# EAGLE design Thermocouple (EAGLE 7.3.0)
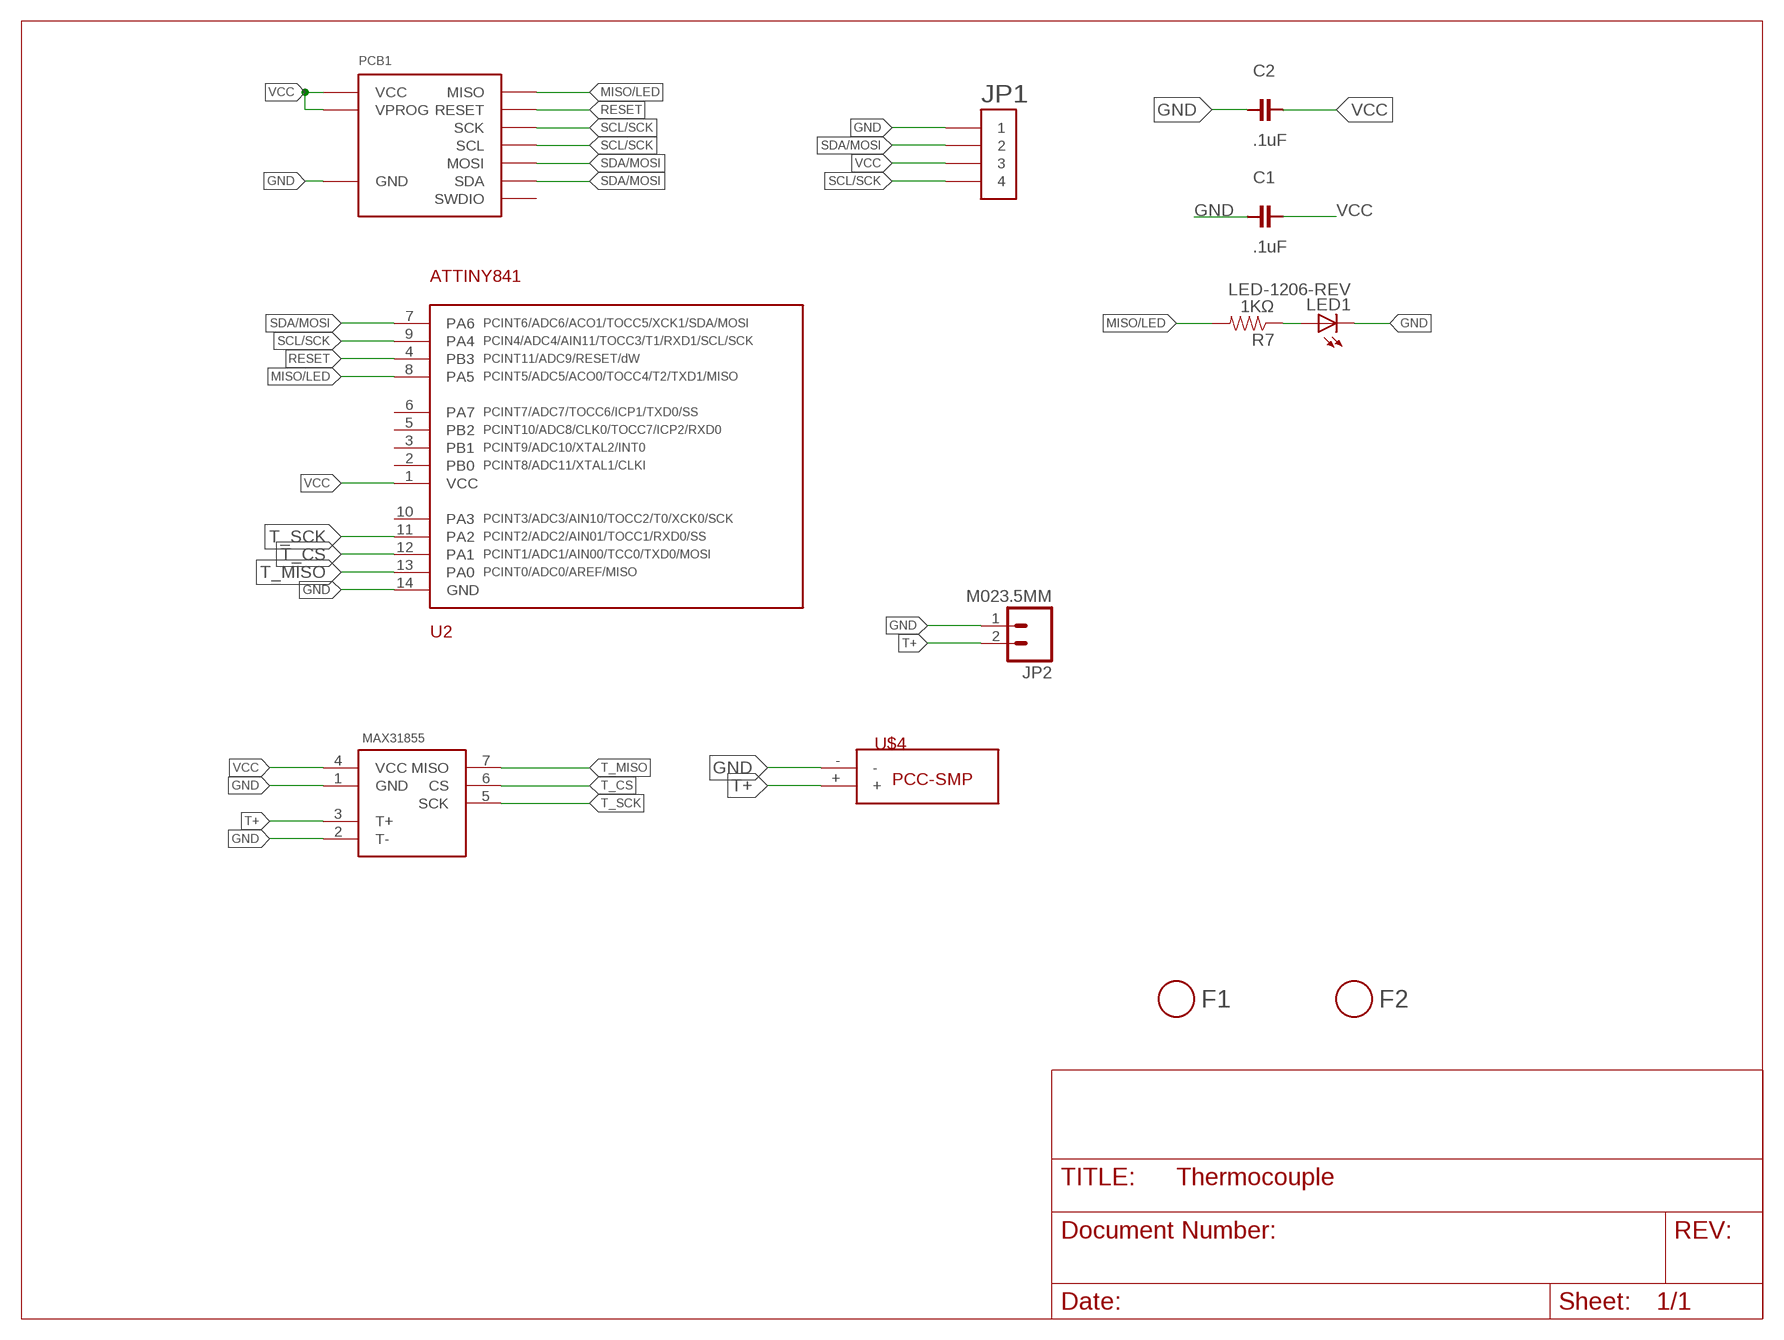
[diagram p0: schematic, sheet 1]
FRAME1 (LETTER_L): BOM: EXCLUDE

## Parts
C1  .1uF  CAPACITOR-.1UF  [0603]
C2  .1uF  CAPACITOR-.1UF  [0603]
F1  FIDUCIAL  [FIDUCIAL_1MM]
F2  FIDUCIAL  [FIDUCIAL_1MM]
JP1  HEADER-1X4-AMPMODU  [AMPMODU-4P]
JP2  M023.5MM  [SCREWTERMINAL-3.5MM-2]
LED1  LED-1206-REV  [LED-1206-REV]
PCB1  DEVICE-PCB  [DEVICE-PCB]
R7  1KΩ  RESISTOR-1KΩ  [0603]
U2  ATTINY841  [SOIC-14]
U$4  PCC-SMP  [PCC-SMP]
U$5  MAX31855  [SOIC-8]

## Nets
GND: C1.2 C2.2 JP1.P$1 JP1.P$2 JP2.1 LED1.C PCB1.GND U2.14(GND) U$4.- U$5.1(GND) U$5.2(T-)
MISO/LED: PCB1.MISO R7.2 U2.8(PA5)
N$7: LED1.A R7.1
RESET: PCB1.RESET U2.4(PB3)
SCL/SCK: JP1.P$7 JP1.P$8 PCB1.CLK(SCK) PCB1.SCL U2.9(PA4)
SDA/MOSI: JP1.P$3 JP1.P$4 PCB1.MOSI PCB1.SDA U2.7(PA6)
T+: JP2.2 U$4.+ U$5.3(T+)
T_CS: U2.12(PA1) U$5.6(CS)
T_MISO: U2.13(PA0) U$5.7(MISO)
T_SCK: U2.11(PA2) U$5.5(SCK)
VCC: C1.1 C2.1 JP1.P$5 JP1.P$6 PCB1.VCC PCB1.VPROG U2.1(VCC) U$5.4(VCC)
Unconnected: PCB1.SWDIO U2.2(PB0) U2.3(PB1) U2.5(PB2) U2.6(PA7) U2.10(PA3)

## Library data of the parts
C1 C2 = Modulo:CAPACITOR: Capacitor; PARTNUM: C0603C104K5RACTU
F1 F2 = Modulo:FIDUCIAL; BOM: EXCLUDE
JP1 = Modulo:HEADER-1X4; PARTNUM: 147721-3
JP2 = SparkFun-Connectors:M02: Standard 2-pin 0.1" header. Use with - straight break away headers ( PRT-00116) - right angle break away headers (PRT-00553) - swiss pins (PRT-00743) - machine pins (PRT-00117) - female headers (PRT-00115) Molex polarized connector foot print use with: PRT-08233 with associated crimp pins and housings. 2.54_SCREWTERM for use with PRT-10571. 3.5mm Screw Terminal footprints for PRT-08084 5mm Screw Terminal footprints for use with PRT-08433
LED1 = Modulo:LED: LED; PARTNUM: LTST-C230TBKT
PCB1 = Modulo:DEVICE-PCB: Modulo Footprint; PARTNUM: Therm PCB
R7 = Modulo:RESISTOR: Resistor Basic schematic elements and footprints for 0603, 1206, and PTH resistors.; PARTNUM: ERJ-3EKF1001V
U2 = Modulo:ATTINY841; PARTNUM: ATTINY841-SSUR
U$4 = Modulo:PCC-SMP
U$5 = IntegerLabs:MAX31855

## Board
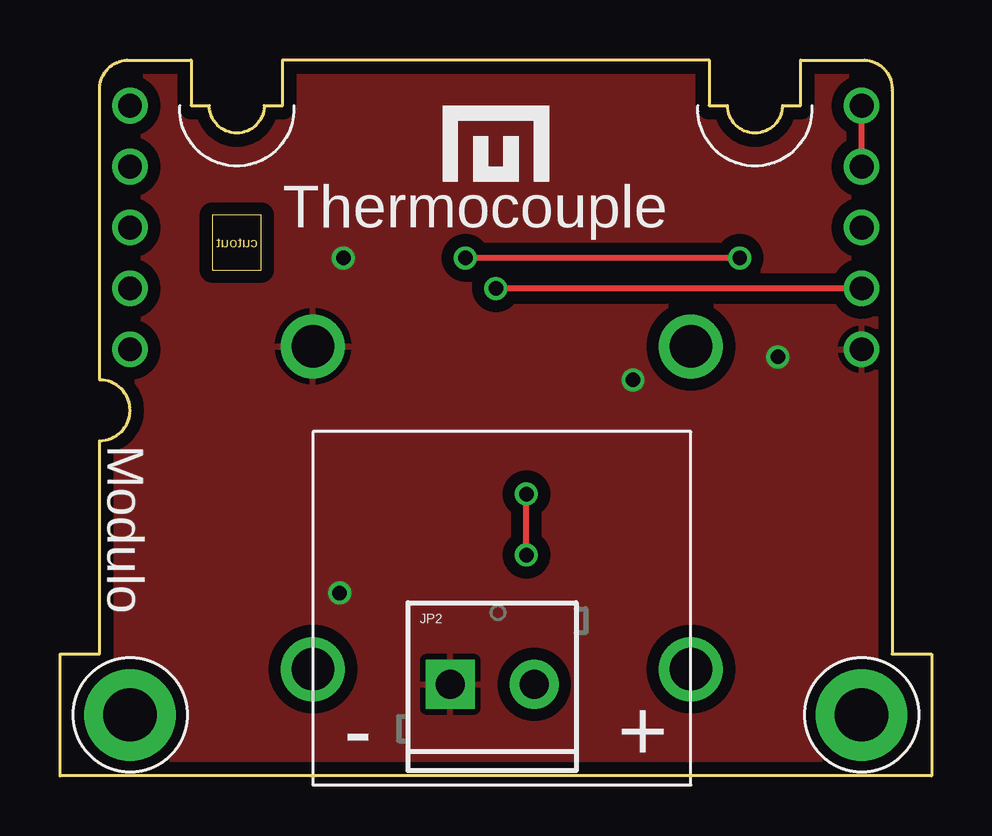
[diagram p1: board, top side]
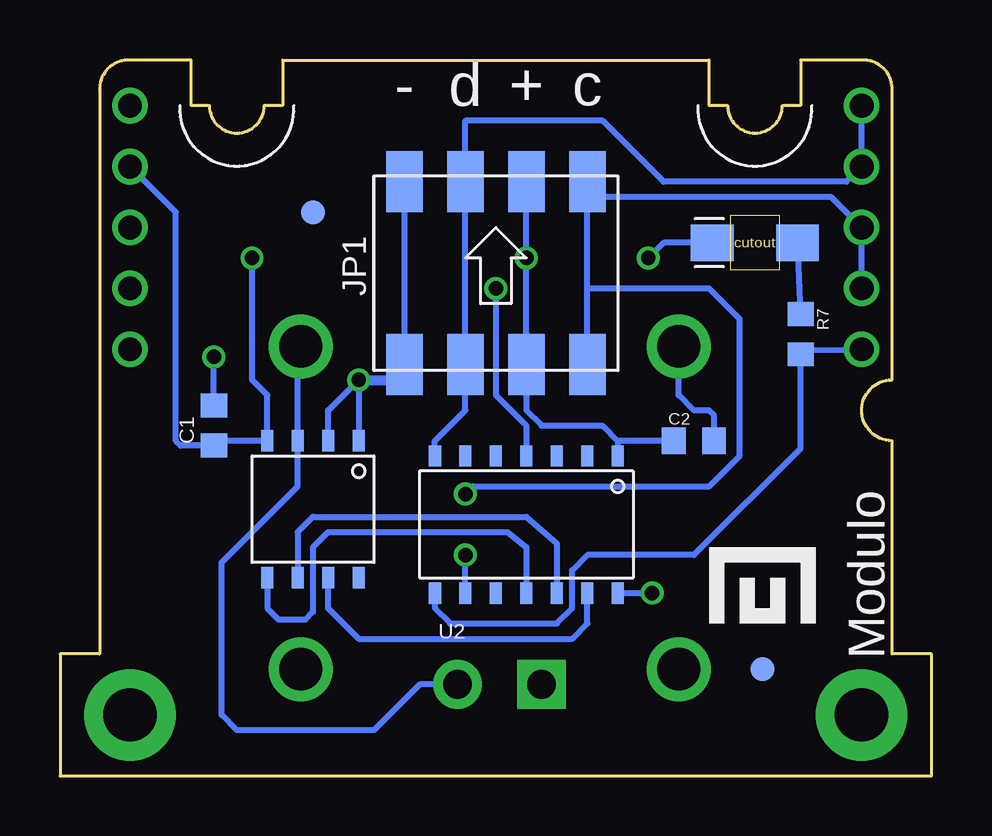
[diagram p2: board, bottom side, seen from below]

Size 36.32 x 29.84 mm. Coordinates in mm from the lower left corner, seen from the top.
Copper layers (1*16): Top 0.0356mm / dielectric 1.5011mm / Bottom 0.0356mm
Design rules "Modulo": minimum track width 6mil, minimum drill 13mil, track to track 6mil, track to pad 6mil, pad to pad 6mil, via to via 6mil, smd to smd 6mil, copper to edge 15mil, drill to drill 6mil, minimum pad ring 7mil, minimum via ring 7mil, stop-mask expansion 3mil, vias tented up to drill 25mil, thermal gap 10mil

### Footprints (pad centres in the part's own frame; a part is rotated, then mirrored left to right if it is on the bottom)
0603 = smd 0.991 x 1.092: 1 -0.838,0; 2 0.838,0
FIDUCIAL_1MM = smd 1 x 1: 1 0,0
AMPMODU-4P = smd 1.524 x 2.54: P$1 -3.81,3.81; P$2 -3.81,-3.81; P$3 -1.27,3.81; P$4 -1.27,-3.81; P$5 1.27,3.81; P$6 1.27,-3.81; P$7 3.81,3.81; P$8 3.81,-3.81
SCREWTERMINAL-3.5MM-2 = drill 1.2 pad 2.032 square: 1 0,0 | drill 1.2 pad 2.032: 2 3.5,0
LED-1206-REV = smd 1.778 x 1.524: A -1.778,0; C 1.778,0
DEVICE-PCB = drill 0.991: CLK 2.54,20.32; GND 33.02,17.78; MISO 2.54,17.78; MOSI 2.54,25.4; RESET 33.02,20.32; SCL 2.54,22.86; SDA 2.54,27.94; SWDIO 33.02,22.86; VCC 33.02,25.4; VPROG 33.02,27.94 | drill 2.223 pad 3.81: P$1 2.54,2.54; P$2 33.02,2.54
SOIC-14 = smd 0.508 x 0.889: 1 0,-3.175; 2 1.27,-3.175; 3 2.54,-3.175; 4 3.81,-3.175; 5 5.08,-3.175; 6 6.35,-3.175; 7 7.62,-3.175; 8 7.62,2.54; 9 6.35,2.54; 10 5.08,2.54; 11 3.81,2.54; 12 2.54,2.54; 13 1.27,2.54; 14 0,2.54
PCC-SMP = drill 1.778: + 15.748,13.462; - 0,13.462; NC1 0,0; NC2 15.748,0
SOIC-8 = smd 0.508 x 0.889: 1 -1.27,-3.175; 2 0,-3.175; 3 1.27,-3.175; 4 2.54,-3.175; 5 2.54,2.54; 6 1.27,2.54; 7 0,2.54; 8 -1.27,2.54

### Placement (x,y rotation side)
C1  29.91,14.61 90 bottom
C2  9.91,13.97 0 bottom
F1  7.05,4.45 0 bottom
F2  25.78,23.5 0 bottom
JP1  18.16,20.95 0 bottom
JP2  16.26,3.81 0 top
LED1  7.37,22.23 180 bottom
PCB1  0.38,0 0 top
R7  5.46,18.41 270 bottom
U2  13.08,10.16 180 bottom
U$2  [LOGO-SMALL]  7.37,6.99 0 bottom
U$3  [LOGO-SMALL]  17.84,25.4 0 top
U$4  10.54,4.45 0 top
U$5  25.15,10.79 180 bottom

### Tracks (layer width: path | path; a pad name or v marks a point on that pad's centre or on a via)
GND  (via drill 0.6)
  Bottom 0.254: LED1.C 11.18,22.23 v11.81,21.59 | U2.14 v11.65,7.62 | C1.2 v29.91,17.46 | JP1.P$1 JP1.P$2 | C2.2 9.07,15.04 9.27,15.24 9.91,15.24 10.54,15.88 U$4.- | U$5.1 v23.88,16.51 25.15,15.24 U$5.2
  Bottom 0.406: v23.88,16.51 22.61,16.51 JP1.P$2
  pour Top (isolate 0.508, rank 2): 35.94,0 35.94,30.48 0.38,30.48 0.38,0
MISO/LED
  Bottom 0.254: PCB1.MISO 5.27,17.75 R7.2 5.46,13.65 9.91,9.21 14.35,9.21 14.99,8.57 14.99,6.99 15.62,6.35 20.07,6.35 20.7,6.99 U2.8
N$7
  Bottom 0.254: R7.1 LED1.A
RESET  (via drill 0.6)
  Top 0.254: PCB1.RESET v18.16,20.32
  Bottom 0.254: v18.16,20.32 18.16,15.88 16.89,14.61 U2.4
SCL/SCK  (via drill 0.6)
  Top 0.254: v19.43,9.21 v19.43,11.75
  Bottom 0.254: JP1.P$8 14.35,20.32 | 14.35,20.32 14.35,24.13 | 14.35,24.13 JP1.P$7 | 14.35,24.13 4.19,24.13 PCB1.SCL PCB1.CLK | 14.35,20.32 9.27,20.32 8,19.05 8,13.34 9.27,12.06 19.11,12.06 v19.43,11.75 | U2.9 v19.43,9.21
SDA/MOSI
  Bottom 0.203: JP1.P$3 19.43,25.4
  Bottom 0.254: JP1.P$3 JP1.P$4 19.43,15.24 20.7,13.97 U2.7 | 19.43,25.4 19.43,27.3 13.72,27.3 11.18,24.77 3.56,24.77 PCB1.MOSI PCB1.SDA
T+
  Bottom 0.254: JP2.2 21.34,3.81 23.24,1.91 28.96,1.91 29.59,2.54 29.59,8.89 26.42,12.06 U$5.3 26.42,17.78 U$4.+
T_CS
  Bottom 0.254: U2.12 15.62,9.68 16.89,10.79 25.78,10.79 26.42,10.16 U$5.6
T_MISO
  Bottom 0.254: U2.13 14.35,6.35 14.99,5.71 23.88,5.71 25.15,6.99 U$5.7
T_SCK
  Bottom 0.254: U$5.5 27.69,6.99 27.21,6.51 26.1,6.51 25.78,6.83 25.78,9.53 25.15,10.16 17.68,10.16 16.89,9.53 U2.11
VCC  (via drill 0.6)
  Top 0.254: PCB1.VCC PCB1.VPROG | v28.32,21.59 v16.89,21.59
  Bottom 0.254: 16.57,18.1 16.89,18.41 | 16.89,18.41 JP1.P$6 16.89,15.24 16.26,14.61 13.72,14.61 13.08,13.97 | 13.08,13.97 U2.1 | PCB1.VCC 31.5,23.5 31.5,13.97 31.29,13.77 C1.1 29.71,13.97 U$5.4 27.69,15.88 28.32,16.51 v28.32,21.59 | 16.89,18.41 v16.89,21.59 JP1.P$5 | C2.1 13.08,13.97

### Text on the board
tPlace: Thermocouple